# EAGLE design foArduinoMega (EAGLE 9.6.1)
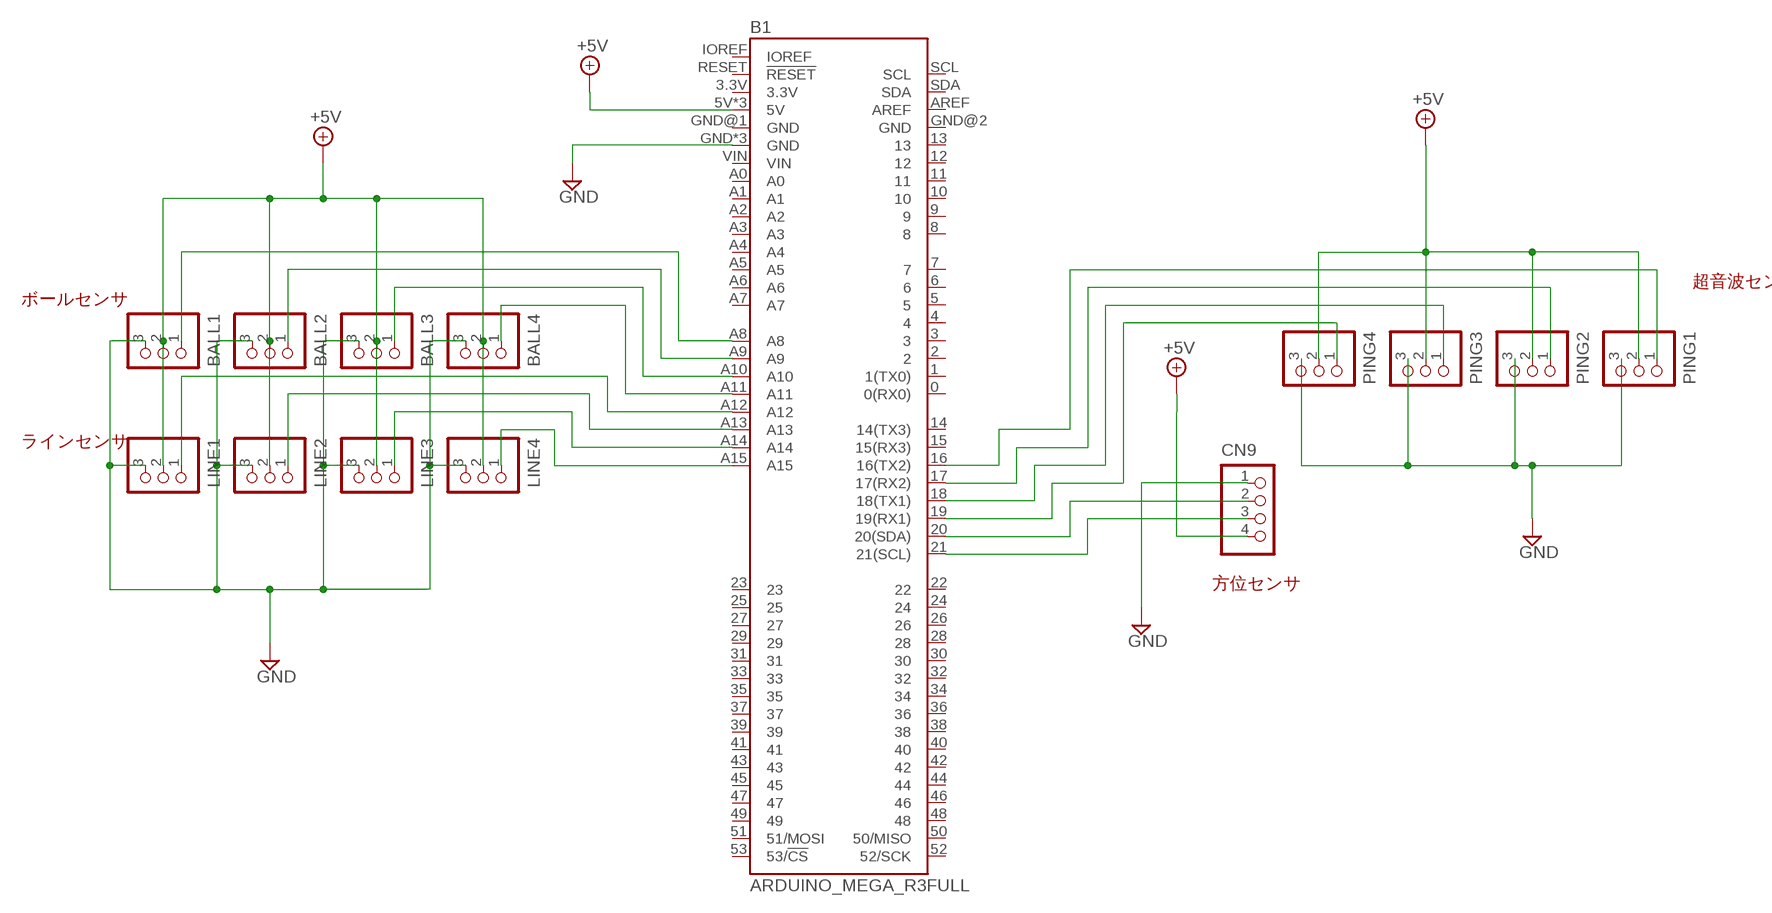
[diagram p0: schematic, sheet 1]

## Parts
B1  ARDUINO_MEGA_R3FULL  [ARDUINO_MEGA_NO_SILK]
BALL1  B3B-XH-A  [B3B-XH-A]
BALL2  B3B-XH-A  [B3B-XH-A]
BALL3  B3B-XH-A  [B3B-XH-A]
BALL4  B3B-XH-A  [B3B-XH-A]
CN9  B4B-XH-A  [B4B-XH-A]
LINE1  B3B-XH-A  [B3B-XH-A]
LINE2  B3B-XH-A  [B3B-XH-A]
LINE3  B3B-XH-A  [B3B-XH-A]
LINE4  B3B-XH-A  [B3B-XH-A]
PING1  B3B-XH-A  [B3B-XH-A]
PING2  B3B-XH-A  [B3B-XH-A]
PING3  B3B-XH-A  [B3B-XH-A]
PING4  B3B-XH-A  [B3B-XH-A]

## Nets
+5V: B1.5V B1.5V@1(5V) B1.5V@2(5V) BALL1.2 BALL2.2 BALL3.2 BALL4.2 CN9.4 LINE1.2 LINE2.2 LINE3.2 LINE4.2 PING1.2 PING2.2 PING3.2 PING4.2
GND: B1.GND B1.GND@3(GND) B1.GND@4(GND) BALL1.3 BALL2.3 BALL3.3 BALL4.3 CN9.1 LINE1.3 LINE2.3 LINE3.3 LINE4.3 PING1.3 PING2.3 PING3.3 PING4.3
N$1: B1.A11 BALL4.1
N$2: B1.A10 BALL3.1
N$3: B1.A9 BALL2.1
N$4: B1.A8 BALL1.1
N$5: B1.A15 LINE4.1
N$6: B1.A14 LINE3.1
N$7: B1.A13 LINE2.1
N$8: B1.A12 LINE1.1
N$9: B1.21(21(SCL)) CN9.3
N$10: B1.20(20(SDA)) CN9.2
N$11: B1.17(17(RX2)) PING2.1
N$12: B1.16(16(TX2)) PING1.1
N$13: B1.19(19(RX1)) PING4.1
N$14: B1.18(18(TX1)) PING3.1
Unconnected: B1.0(0(RX0)) B1.1(1(TX0)) B1.2 B1.3 B1.3.3V B1.4 B1.5 B1.6 B1.7 B1.8 B1.9 B1.10 B1.11 B1.12 B1.13 B1.14(14(TX3)) B1.15(15(RX3)) B1.22 B1.23 B1.24 B1.25 B1.26 B1.27 B1.28 B1.29 B1.30 B1.31 B1.32 B1.33 B1.34 B1.35 B1.36 B1.37 B1.38 B1.39 B1.40 B1.41 B1.42 B1.43 B1.44 B1.45 B1.46 B1.47 B1.48 B1.49 B1.50(50/MISO) B1.51(51/MOSI) B1.52(52/SCK) B1.53(53/!CS) B1.A0 B1.A1 B1.A2 B1.A3 B1.A4 B1.A5 B1.A6 B1.A7 B1.AREF B1.GND@1(GND) B1.GND@2(GND) B1.IOREF B1.RESET(!RESET) B1.SCL B1.SDA B1.VIN

## Notes on the sheet
- 超音波センサ
- ボールセンサ
- ラインセンサ
- 方位センサ

## Library data of the parts
B1 = SparkFun-Boards:ARDUINO_MEGA_R3: Arduino Mega R3 ATmega2560 R3 compatible footprint. SparkFun Products: Arduino Mega 2560 R3 <https://www.sparkfun.com/products/11061>
BALL1-BALL4 LINE1-LINE4 PING1-PING4 = jst-xh:B3B-XH-A: Wire-to-Board 2.5mm pitch top mount connector Source: http://www.jst-mfg.com/product/pdf/jpn/XH.pdf http://www.jst-mfg.com/product/detail.php?series=277
CN9 = jst-xh:B4B-XH-A: Wire-to-Board 2.5mm pitch top mount connector Source: http://www.jst-mfg.com/product/pdf/jpn/XH.pdf http://www.jst-mfg.com/product/detail.php?series=277

## Board
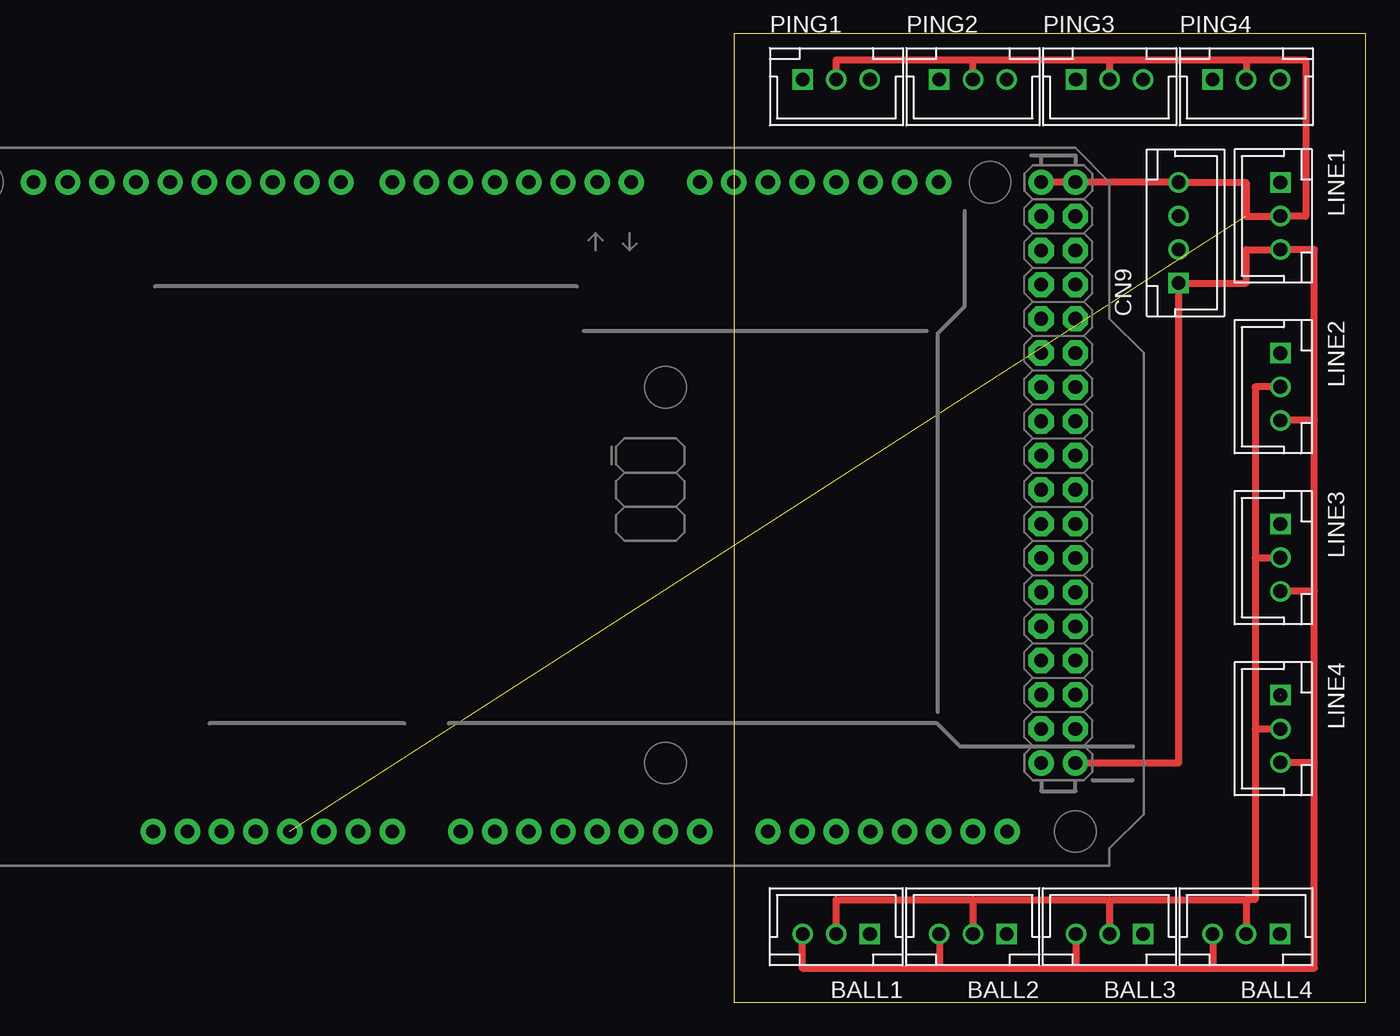
[diagram p1: board, top side]
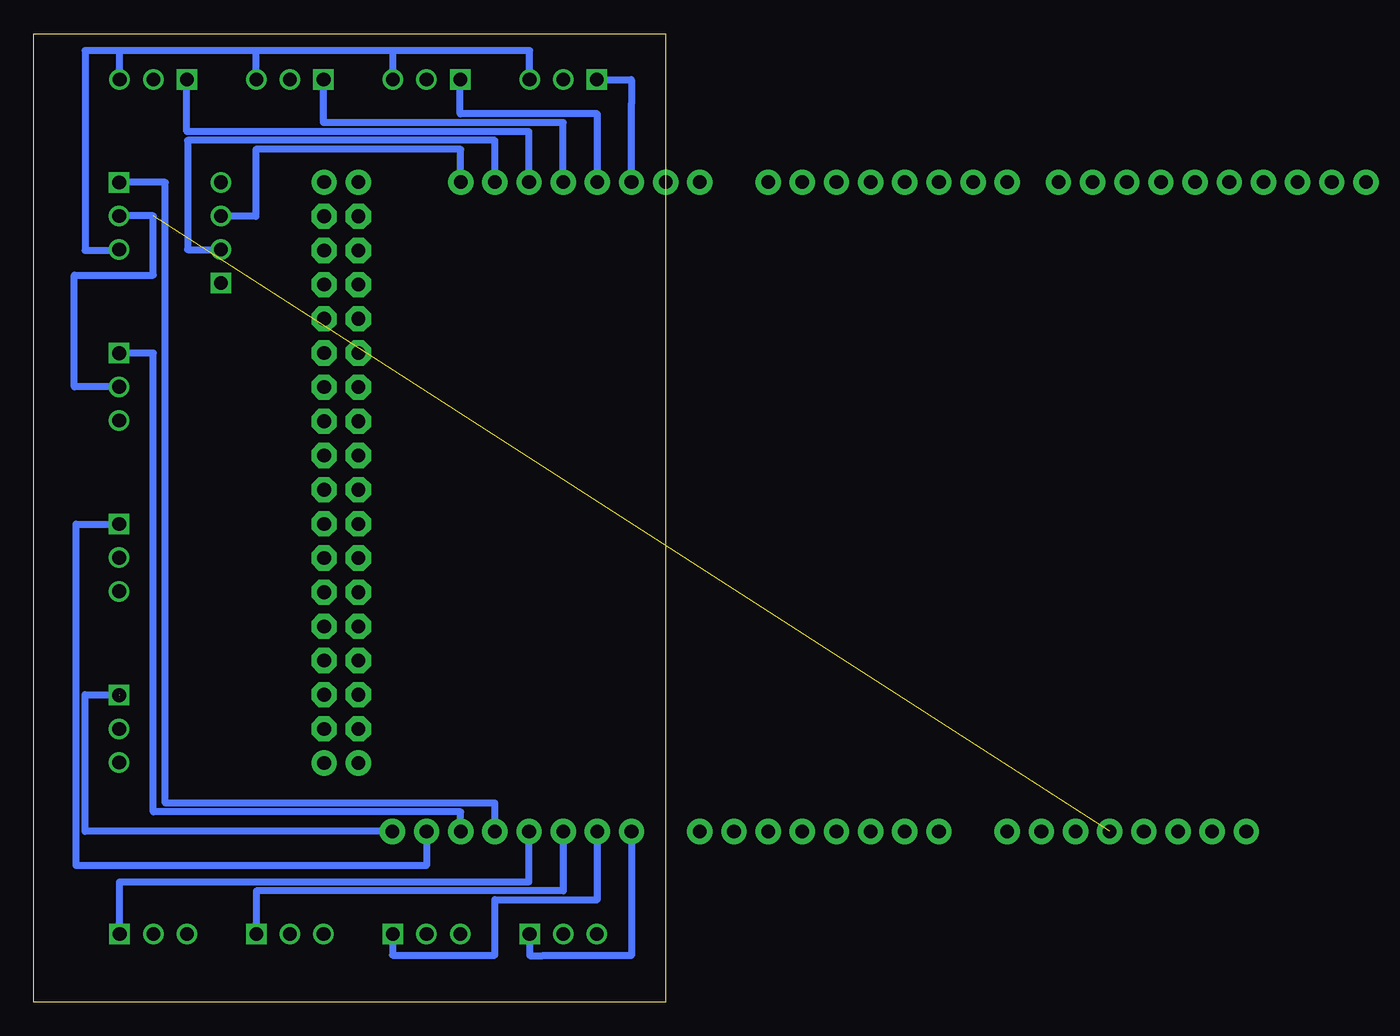
[diagram p2: board, bottom side, seen from below]

Size 47 x 72 mm. Coordinates in mm from the lower left corner, seen from the top.
Outline: 0,0 47,0 47,72 0,72 0,0
Copper layers (1*16): Top 0.035mm / dielectric 1.5mm / Bottom 0.035mm
Design rules "default": minimum track width 6mil, minimum drill 0.35mm, track to track 6mil, track to pad 6mil, pad to pad 6mil, via to via 6mil, smd to smd 6mil, copper to edge 40mil, drill to drill 6mil, minimum pad ring 10mil, minimum via ring 8mil, stop-mask expansion 4mil, vias tented up to drill 0mil, thermal gap 10mil

### Footprints (pad centres in the part's own frame; a part is rotated, then mirrored left to right if it is on the bottom)
ARDUINO_MEGA_NO_SILK = drill 1.016 pad 1.88: 0 13.97,24.13; 1 11.43,24.13; 2 8.89,24.13; 3 6.35,24.13; 3.3V -13.97,-24.13; 4 3.81,24.13; 5 1.27,24.13; 5V -11.43,-24.13; 5V@1 44.45,24.13; 5V@2 46.99,24.13; 6 -1.27,24.13; 7 -3.81,24.13; 8 -7.62,24.13; 9 -10.16,24.13; 10 -12.7,24.13; 11 -15.24,24.13; 12 -17.78,24.13; 13 -20.32,24.13; 14 19.05,24.13; 15 21.59,24.13; 16 24.13,24.13; 17 26.67,24.13; 18 29.21,24.13; 19 31.75,24.13; 20 34.29,24.13; 21 36.83,24.13; A0 1.27,-24.13; A1 3.81,-24.13; A2 6.35,-24.13; A3 8.89,-24.13; A4 11.43,-24.13; A5 13.97,-24.13; A6 16.51,-24.13; A7 19.05,-24.13; A8 24.13,-24.13; A9 26.67,-24.13; A10 29.21,-24.13; A11 31.75,-24.13; A12 34.29,-24.13; A13 36.83,-24.13; A14 39.37,-24.13; A15 41.91,-24.13; AREF -25.4,24.13; GND -8.89,-24.13; GND@1 -6.35,-24.13; GND@2 44.45,-19.05; GND@3 46.99,-19.05; GND@4 -22.86,24.13; IOREF -19.05,-24.13; NC -21.59,-24.13; RESET -16.51,-24.13; SCL -30.48,24.13; SDA -27.94,24.13; VIN -3.81,-24.13 | drill 1.016 pad 1.88 octagon: 22 44.45,21.59; 23 46.99,21.59; 24 44.45,19.05; 25 46.99,19.05; 26 44.45,16.51; 27 46.99,16.51; 28 44.45,13.97; 29 46.99,13.97; 30 44.45,11.43; 31 46.99,11.43; 32 44.45,8.89; 33 46.99,8.89; 34 44.45,6.35; 35 46.99,6.35; 36 44.45,3.81; 37 46.99,3.81; 38 44.45,1.27; 39 46.99,1.27; 40 44.45,-1.27; 41 46.99,-1.27; 42 44.45,-3.81; 43 46.99,-3.81; 44 44.45,-6.35; 45 46.99,-6.35; 46 44.45,-8.89; 47 46.99,-8.89; 48 44.45,-11.43; 49 46.99,-11.43; 50 44.45,-13.97; 51 46.99,-13.97; 52 44.45,-16.51; 53 46.99,-16.51
B3B-XH-A = drill 1.016 square: 1 -2.5,0 | drill 1.016: 2 0,0; 3 2.5,0
B4B-XH-A = drill 1.016 square: 1 -3.75,0 | drill 1.016: 2 -1.25,0; 3 1.25,0; 4 3.75,0

### Placement (x,y rotation side)
B1  -21.59,36.83 0 top
BALL1  7.62,5.08 180 top
BALL2  17.78,5.08 180 top
BALL3  27.94,5.08 180 top
BALL4  38.1,5.08 180 top
CN9  33.07,57.2 90 top
LINE1  40.64,58.45 270 top
LINE2  40.64,45.75 270 top
LINE3  40.64,33.05 270 top
LINE4  40.64,20.32 270 top
PING1  7.62,68.58 0 top
PING2  17.78,68.58 0 top
PING3  27.94,68.58 0 top
PING4  38.1,68.58 0 top

### Tracks (layer width: path | path; a pad name or v marks a point on that pad's centre or on a via)
+5V  (1 unrouted)
  Top 0.508: PING1.2 7.62,70.05 17.78,70.05 | PING2.2 17.78,70.05 | 17.78,70.05 27.94,70.05 | 27.94,70.05 PING3.2 | 27.94,70.05 38.1,70.05 | 38.1,70.05 PING4.2 | 38.1,70.05 42.52,70.05 42.52,58.42 40.64,58.42 | 40.64,58.42 LINE1.2 | 40.64,58.42 38.1,58.42 38.1,60.95 CN9.4 B1.5V@2 B1.5V@1 | BALL1.2 7.62,7.62 17.78,7.62 | 17.78,7.62 BALL2.2 | 17.78,7.62 27.94,7.62 | 27.94,7.62 BALL3.2 | 27.94,7.62 38.1,7.62 | 38.1,7.62 BALL4.2 | LINE2.2 38.76,45.74 38.76,33.02 | 38.1,7.62 38.76,7.62 38.76,20.32 | 38.76,33.02 38.76,20.32 | 38.76,20.32 LINE4.2 | LINE3.2 40.64,33.02 38.76,33.02
  Bottom 0.508: LINE2.2 43.97,45.74 43.97,54.05 38.1,54.05 38.1,58.45 LINE1.2
GND
  Top 0.508: BALL1.3 5.08,5.08 5.08,2.54 15.28,2.54 | BALL2.3 15.28,2.54 | BALL3.3 25.44,2.54 | 15.28,2.54 25.44,2.54 | BALL4.3 35.6,2.54 | 25.44,2.54 35.6,2.54 | 35.6,2.54 43.18,2.54 43.18,17.82 | LINE4.3 43.18,17.82 | 43.18,17.82 43.18,30.55 | 43.18,30.55 LINE3.3 | 43.18,30.55 43.18,43.24 | 43.18,43.24 LINE2.3 | 43.18,43.24 43.18,55.95 LINE1.3 38.1,55.95 38.1,53.45 CN9.1 33.07,17.78 B1.GND@3
  Bottom 0.508: 20.28,70.73 10.12,70.73 PING1.3 | 20.28,70.73 30.44,70.73 | 30.44,70.73 40.6,70.73 | 40.6,70.73 43.18,70.73 43.18,55.88 40.64,55.88 LINE1.3 | PING2.3 20.28,70.73 | PING3.3 30.44,70.73 | PING4.3 40.6,70.73
N$1
  Bottom 0.508: BALL4.1 40.6,8.94 10.16,8.94 B1.A11
N$2
  Bottom 0.508: B1.A10 7.62,8.28 30.44,8.28 BALL3.1
N$3
  Bottom 0.508: BALL2.1 20.32,5.08 20.32,3.5 12.7,3.5 12.7,7.62 5.08,7.62 B1.A9
N$4
  Bottom 0.508: B1.A8 2.54,3.45 9.14,3.45 10.12,3.45 BALL1.1
N$5  (1 unrouted)
  Bottom 0.508: B1.A15 43.18,12.7 43.18,22.86 40.64,22.86
N$6
  Bottom 0.508: B1.A14 17.78,10.16 43.84,10.16 43.84,35.55 LINE3.1
N$7
  Bottom 0.508: B1.A13 15.24,14.15 38.1,14.15 38.1,48.24 LINE2.1
N$8
  Bottom 0.508: B1.A12 12.7,14.81 37.21,14.81 37.21,60.95 LINE1.1
N$9
  Bottom 0.508: B1.21 15.24,63.4 30.48,63.4 30.48,58.42 33.07,58.42 CN9.3
N$10
  Bottom 0.508: B1.20 12.7,64.06 35.56,64.06 35.56,55.95 CN9.2
N$11
  Bottom 0.508: B1.17 5.08,66.04 15.28,66.04 PING2.1
N$12
  Bottom 0.508: B1.16 2.54,66.04 2.54,66.78 2.54,68.58 PING1.1
N$13
  Bottom 0.508: B1.19 10.16,63.5 10.16,64.72 35.6,64.72 PING4.1
N$14
  Bottom 0.508: B1.18 7.62,65.38 25.44,65.38 PING3.1